# Altium schematic sheet Shield.SchDoc
size A4; SheetNumber: 1; SheetTotal: 1
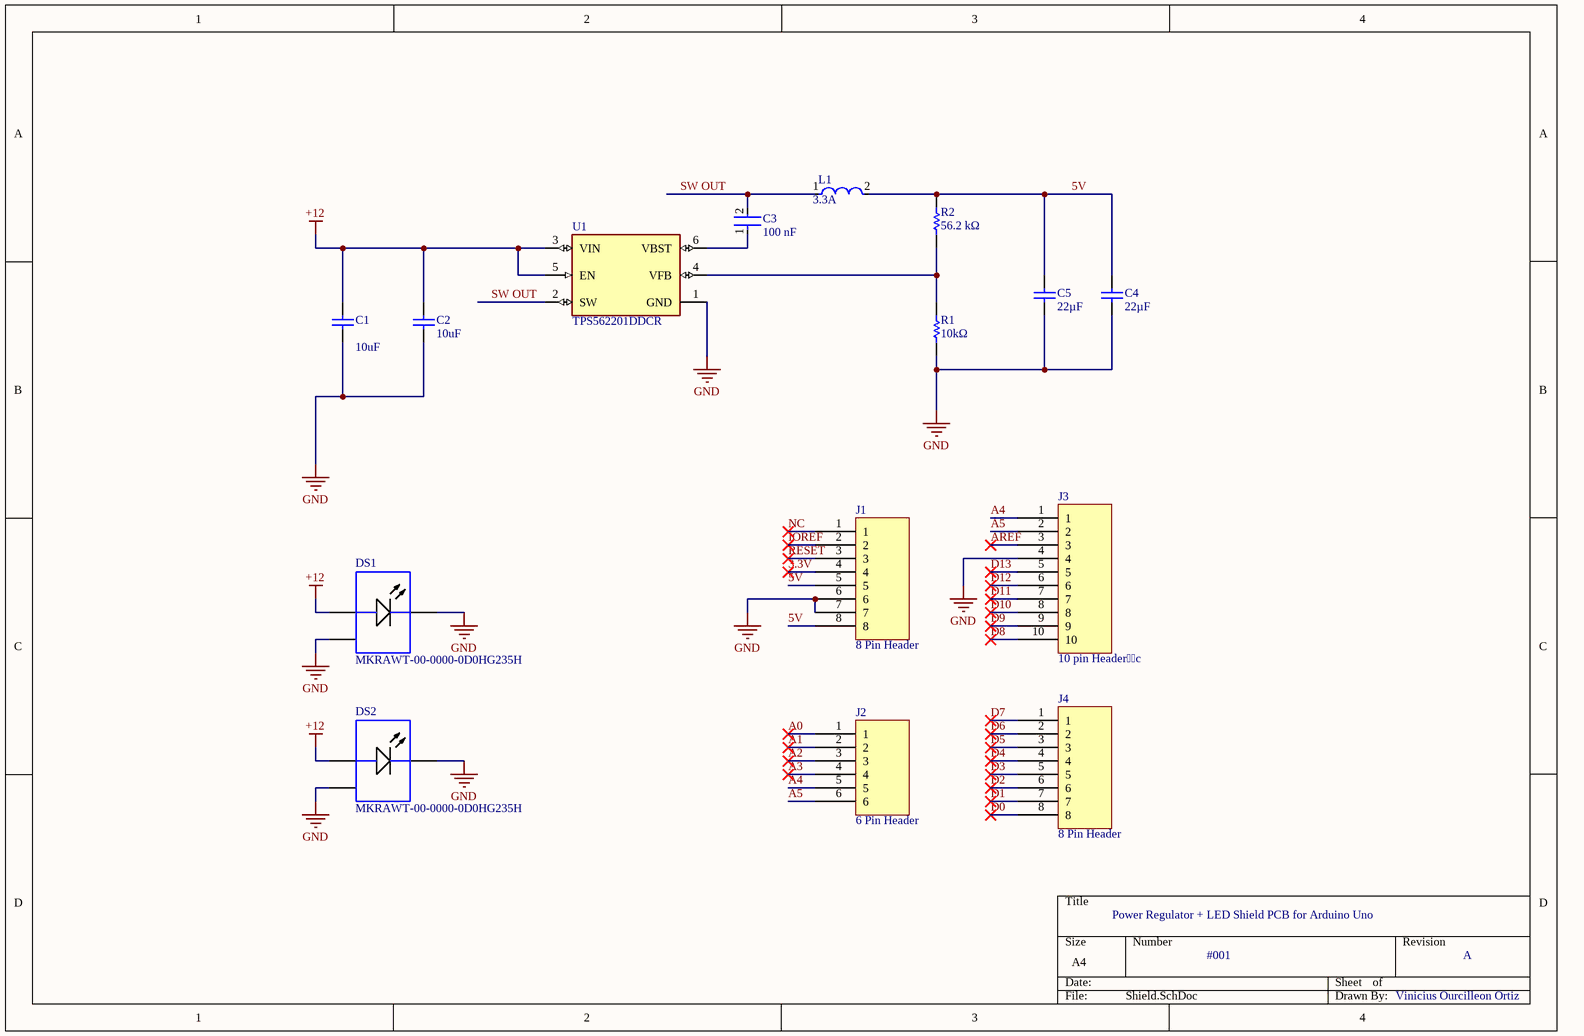
[diagram p0: Shield.SchDoc]

## Parts
C1  Capacitance: 10uF  [CAPC3216X180X55ML20T25]  (hidden comment: GRM31CR61E106KA12L)
C2  Capacitance: 10uF  [CAPC3216X180X55ML20T25]  (hidden comment: GRM31CR61E106KA12L)
C3  Capacitance: 100 nF  [FP-CC0805-0_85-MFG]  (hidden comment: CC0805KRX7R8BB104)
C4  Capacitance: 22µF  [CAPC1608X100X20ML10]  (hidden comment: C1608X5R1A226M080AC)
C5  Capacitance: 22µF  [CAPC1608X100X20ML10]  (hidden comment: C1608X5R1A226M080AC)
DS1  MKRAWT-00-0000-0D0HG235H  [CREE-MK-R-2_V]
DS2  MKRAWT-00-0000-0D0HG235H  [CREE-MK-R-2_V]
J1  8 Pin Header  [SSQ-108-03-T-S-Footprint-1]
J2  6 Pin Header  [SSQ-106-03-T-S-Footprint-1]
J3  10 pin Headerc  [FP-SSQ-110-03-T-S-MFG]
J4  8 Pin Header  [SSQ-108-03-T-S-Footprint-1]
L1  Saturation Current: 3.3A  [FP-IHLP-1212BZ-11-MFG]  (hidden comment: IHLP1212BZER3R3M11)
R1  value 10kΩ  [RESC0603X28X15LL05T05]  (hidden comment: CRCW020110K0FKED)
R2  value 56.2 kΩ  [RESC0603X28X15NL05T05]  (hidden comment: CRCW020156K2FKED)
U1  TPS562201DDCR  [FP-DDC0006A-IPC_C]

## Nets
+12: C1.1 C2.1 DS1.1(A) DS2.1(A) U1.3(VIN) U1.5(EN)
GND: C1.2 C2.2 C4.2 C5.2 DS1.2(K) DS1.3(EP) DS2.2(K) DS2.3(EP) J1.6 J1.7 J3.4 R1.2 U1.1(GND)
3.3V: J1.4
5V: C4.1 C5.1 J1.5 J1.8 L1.2 R2.1
A0: J2.1
A1: J2.2
A2: J2.3
A3: J2.4
A4: J2.5 J3.1
A5: J2.6 J3.2
AREF: J3.3
D0: J4.8
D1: J4.7
D2: J4.6
D3: J4.5
D4: J4.4
D5: J4.3
D6: J4.2
D7: J4.1
D8: J3.10
D9: J3.9
D10: J3.8
D11: J3.7
D12: J3.6
D13: J3.5
IOREF: J1.2
NC: J1.1
RESET: J1.3
SW OUT: C3.2 L1.1 U1.2(SW)
NetC3_1: C3.1 U1.6(VBST)
NetR1_1: R1.1 R2.2 U1.4(VFB)

## Notes on the sheet
- Power Regulator + LED Shield PCB for Arduino Uno
- #001
- A
- Vinicius Ourcilleon Ortiz

## Library data of the parts
C1 C2 = CMP-2000-04947-1: Chip Capacitor, 10 uF, +/- 10%, 25 V, -55 to 85 degC, 1206 (3216 Metric), RoHS, Tape and Reel; Manufacturer: Murata; Case Height: 1.6mm; Voltage Rating DC: 25V; Type: GeneralPurposeMLCC; Dielectric: X5R; Case Length: 3.2mm; Brand: MurataElectronics; Maximum Operating Temperature: +85C; Datasheet URL: https://datasheet.ciiva.com/11786/0900766b80ef921d-11786983.pdf; Tolerance: 10%; Case Code - mm: 3216; Datasheet Version: Sep-13; Packaging: Reel; Product Category: MultilayerCeramicCapacitorsMLCC-SMD/SMT; Manufacturer URL: http://www.murata.com/; Factory Pack Quantity: 2000; Minimum Operating Temperature: -55C; Product: GeneralTypeMLCCs; Package Reference: 1206; RoHS: Details; Package / Case: 1206(3216metric); Package Description: 2-Pin Surface Mount Device, Body 3.2 x 1.6 mm; Case Code - in: 1206; Termination Style: SMD/SMT; Series: GRM; Case Width: 1.6mm
C3 = CMP-1036-04410-2: CAP CER 0.1UF 25V X7R 0805; Manufacturer: Yageo; Tolerance: 0.1; Material: Ceramic; Value: 100 nF; ComponentLink2URL: http://www.yageo.com/documents/recent/UPY-GPHC_Y5V_6.3V-to-50V_8.pdf; Category: Cap; Mouser Description: Multilayer Ceramic Capacitors MLCC - SMD/SMT 100nF 25V X7R 10%; Manufacturer Part Number: CC0805KRX7R8BB104; Device Class L1: Passive Components; Footprint Url: http://www.yageo.com/exep/pages/download/literatures/UPY-C_GEN_24.pdf; Height: 0.95mm; Digikey Description: CAP CER 0.1UF 25V X7R 0805; Lead Free: Yes; Temperature Range High: +85°C; Temperature: -30°C to +85°C; Ipc Land Pattern Name: CAPC200125X85; Automotive: No; Octopart: https://octopart.com/cc0805krx7r8bb104-yageo-39467766; Device Class L2: Capacitors; Temperature Characteristic: X7R; Voltage Rating: 25 V; ComponentLink2Description: Datasheet; Temperature Range Low: -30°C; Device Class L3: Ceramic Capacitors; RoHS: TRUE; Package: CC0805-0.85
C4 C5 = CMP-2000-05441-1: Chip Capacitor, 22 uF, +/- 20%, 10 V, -55 to 85 degC, 0603 (1608 Metric), RoHS, Tape and Reel; Manufacturer: TDK; PCN Part Number: MLCCPartNumberChange30/Nov/2012; Voltage - Rated: 10V; Product Training Modules: CSeriesGeneralApplicationsSEAT,CCV,andTVCLDesignToolsGuidetoReplacinganElectrolyticCapacitorwithanMLCC; Other Names: 445-9077-1; Design Resources: 20WNon-IsolatedBuckLEDDriverUsingPLLNK460KG; Online Catalog: CSeries,GeneralPurpose; Temperature Coefficient: X5R; Kits: 445-9014-KIT-ND-KITMLCC100PF-22UF060310-50V; Packaging: CutTape(CT); Standard Package: 1; Package / Case: 0603(1608Metric); Lead Style: -; Features: -; Ratings: -; Operating Temperature: -55degC~85degC; Applications: GeneralPurpose; Package Reference: 603; Datasheet URL: http://download.siliconexpert.com/pdfs/2015/4/21/15/54/45/779/tdk_/manual/37024850441143360mlcc_commercial_general_en.pdf; Datasheet Version: Mar-15; Mounting Type: SurfaceMount,MLCC; Lead Spacing: -; Size / Dimension: 0.063"Lx0.031"W(1.60mmx0.80mm); Height - Seated (Max): -; Package Description: 2-Pin Surface Mount Device, Body 1.6 x 0.8 mm; Manufacturer URL: http://www.tdk.com/; RoHS Information: RoHSCertificate-MLCC; Tolerance: ±20%; Series: C; Thickness (Max): 0.035"(0.90mm); Family: CeramicCapacitors; Category: Capacitors
DS1 DS2 = CMP-2100-00977-1: LED, White, 12 V, 2-Pin SMD, RoHS, Tape and Reel
J1 J4 = CMP-002-00076-2: Board Connector, 8 Contact(s), 1 Row(s), Female, Straight, 0.1 inch Pitch, Solder Terminal, Black Insulator, Socket; Connector Type: BOARD CONNECTOR; Max Operating Temperature: 105°C; Min Operating Temperature: -65°C; Mounting Technology: Board; RoHS Compliant: Yes
J2 = CMP-002-00078-1: Board Connector, 6 Contact(s), 1 Row(s), Female, Straight, 0.1 inch Pitch, Solder Terminal, Locking, Black Insulator, Socket; RoHS Compliant: Yes; Mounting Technology: Board; Connector Type: BOARD CONNECTOR; Min Operating Temperature: -65°C; Max Operating Temperature: 105°C
J3 = CMP-002-00079-2: Board Connector, 10 Contact(s), 1 Row(s), Female, Straight, 0.1 inch Pitch, Solder Terminal, Black Insulator, Socket; RoHS Compliant: Yes; Min Operating Temperature: -65°C; Connector Type: BOARD CONNECTOR; Max Operating Temperature: 105°C; Mounting Technology: Board
L1 = CMP-02424-000857-1: FIXED IND 3.3UH 2.7A 61 MOHM SMD; DC Resistance (DCR): 61mR; Test Frequency: 100kHz; Self Resonant Frequency: 45MHz; Shielding: Shielded; Tolerance: 20%; Core Material: Ferrite; Max DC Current: 2.7A; Current Rating: 2.7A; Mount: Surface Mount; Radiation Hardening: No; Number of Pins: 2; Length: 0.144inch; Max Operating Temperature: 125°C; Contact Plating: Tin; Depth: 3.2mm; Case Code (Metric): 3630; Height - Seated (Max): 0.079inch; Termination: SMD/SMT; Width: 0.118inch; Series: IHLP-1212BZ-11; Lead Free: Lead Free; RMS Current (Irms): 2.7A; Package Quantity: 3000; Height: 2mm; Case Code (Imperial): 1212; Military Standard: Not; Inductance Tolerance: 20%; Packaging: Tape and Reel; Min Operating Temperature: -55°C; Case/Package: 1212; Inductance: 3.3uH
R1 = CMP-2004-00015-1: Manufacturer: Vishay Dale; Part Number: CRCW020110K0FKED
R2 = CMP-2004-00722-1: Manufacturer: Vishay Dale; Part Number: CRCW020156K2FKED
U1 = CMP-04918-000361-1: IC REG BUCK ADJ 2A TSOT23-6; Switching Frequency: 580kHz; Max Input Voltage: 17V; Number of Outputs: 1; Output Voltage: 7V; Output Type: Adjustable; Quiescent Current: 400uA; Min Input Voltage: 4.5V; Mount: Surface Mount; Max Operating Temperature: 125°C; Lead Free: Lead Free; Operating Supply Voltage: 17V; Number of Pins: 6; RoHS Compliant: Yes; Contact Plating: Tin; Min Operating Temperature: -40°C; Case/Package: SOT; Max Output Current: 2A